# EAGLE design MakerBot (EAGLE 6.2)
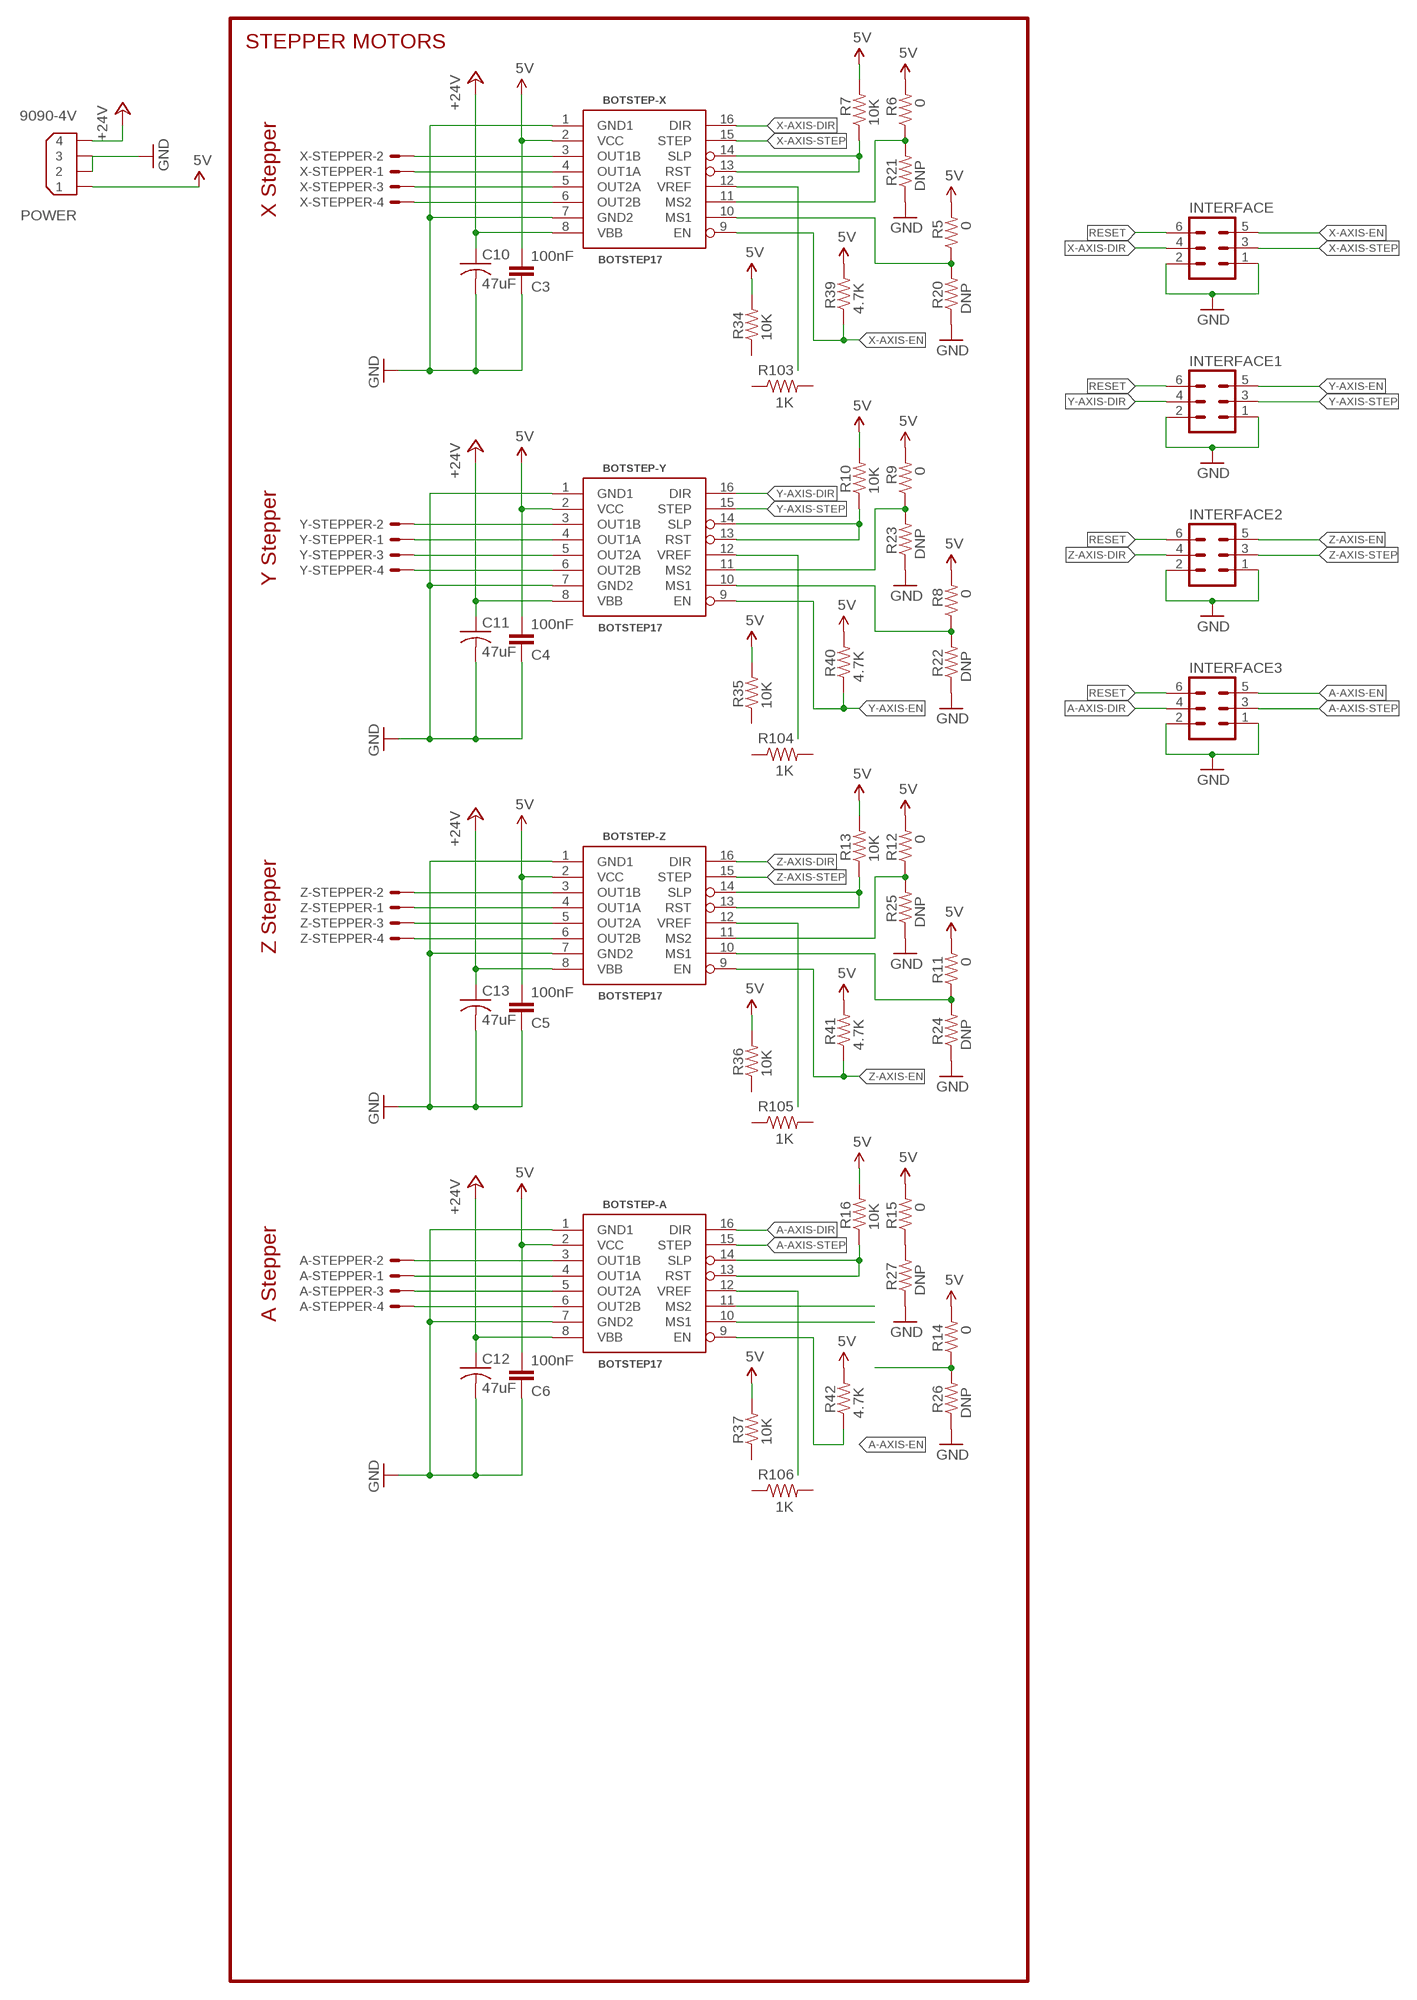
[diagram p0: schematic, sheet 1]

## Parts
A-STEPPER  KK-156-4  [KK-156-4]
BOTSTEP-A  BOTSTEP17  BOTSTEP17CHIP-DOWN  [BOTSTEP17-INV]
BOTSTEP-X  BOTSTEP17  BOTSTEP17CHIP-DOWN  [BOTSTEP17-INV]
BOTSTEP-Y  BOTSTEP17  BOTSTEP17CHIP-DOWN  [BOTSTEP17-INV]
BOTSTEP-Z  BOTSTEP17  BOTSTEP17CHIP-DOWN  [BOTSTEP17-INV]
C3  100nF  CAP0805  [0805]
C4  100nF  CAP0805  [0805]
C5  100nF  CAP0805  [0805]
C6  100nF  CAP0805  [0805]
C10  47uF  C-US050-075X075  [C050-075X075]
C11  47uF  C-US050-075X075  [C050-075X075]
C12  47uF  C-US050-075X075  [C050-075X075]
C13  47uF  C-US050-075X075  [C050-075X075]
INTERFACE  ML6  [ML6]
INTERFACE1  ML6  [ML6]
INTERFACE2  ML6  [ML6]
INTERFACE3  ML6  [ML6]
POWER  9090-4V  [9090-4V]
R5  0  RESISTORPTH1  [AXIAL-0.3]
R6  0  RESISTORPTH1  [AXIAL-0.3]
R7  10K  RESISTORPTH1  [AXIAL-0.3]
R8  0  RESISTORPTH1  [AXIAL-0.3]
R9  0  RESISTORPTH1  [AXIAL-0.3]
R10  10K  RESISTORPTH1  [AXIAL-0.3]
R11  0  RESISTOR  [0805]
R12  0  RESISTOR  [0805]
R13  10K  RESISTOR  [0805]
R14  0  RESISTOR  [0805]
R15  0  RESISTOR  [0805]
R16  10K  RESISTOR  [0805]
R20  DNP  RESISTORPTH1  [AXIAL-0.3]
R21  DNP  RESISTORPTH1  [AXIAL-0.3]
R22  DNP  RESISTORPTH1  [AXIAL-0.3]
R23  DNP  RESISTORPTH1  [AXIAL-0.3]
R24  DNP  RESISTOR  [0805]
R25  DNP  RESISTOR  [0805]
R26  DNP  RESISTOR  [0805]
R27  DNP  RESISTOR  [0805]
R34  10K  RESISTORPTH1  [AXIAL-0.3]
R35  10K  RESISTORPTH1  [AXIAL-0.3]
R36  10K  RESISTOR  [0805]
R37  10K  RESISTOR  [0805]
R39  4.7K  RESISTORPTH1  [AXIAL-0.3]
R40  4.7K  RESISTORPTH1  [AXIAL-0.3]
R41  4.7K  RESISTOR  [0805]
R42  4.7K  RESISTOR  [0805]
R103  1K  RESISTORPTH1  [AXIAL-0.3]
R104  1K  RESISTORPTH1  [AXIAL-0.3]
R105  1K  RESISTOR  [0805]
R106  1K  RESISTOR  [0805]
X-STEPPER  KK-156-4  [KK-156-4]
Y-STEPPER  KK-156-4  [KK-156-4]
Z-STEPPER  KK-156-4  [KK-156-4]

## Nets
5V [5V]: BOTSTEP-A.2(VCC) BOTSTEP-X.2(VCC) BOTSTEP-Y.2(VCC) BOTSTEP-Z.2(VCC) C3.2 C4.2 C5.2 C6.2 POWER.1 R5.P$2 R6.P$2 R7.P$2 R8.P$2 R9.P$2 R10.P$2 R11.2 R12.2 R13.2 R14.2 R15.2 R16.2 R34.P$2 R35.P$2 R36.2 R37.2 R39.P$2 R40.P$2 R41.2 R42.2
+24V [24V]: BOTSTEP-A.8(VBB) BOTSTEP-X.8(VBB) BOTSTEP-Y.8(VBB) BOTSTEP-Z.8(VBB) C10.1 C11.1 C12.1 C13.1 POWER.4
A-AXIS-DIR: BOTSTEP-A.16(DIR) INTERFACE3.4
A-AXIS-EN: BOTSTEP-A.9(EN) INTERFACE3.5 R42.1
A-AXIS-STEP: BOTSTEP-A.15(STEP) INTERFACE3.3
GND [gnd]: BOTSTEP-A.1(GND1) BOTSTEP-A.7(GND2) BOTSTEP-X.1(GND1) BOTSTEP-X.7(GND2) BOTSTEP-Y.1(GND1) BOTSTEP-Y.7(GND2) BOTSTEP-Z.1(GND1) BOTSTEP-Z.7(GND2) C3.1 C4.1 C5.1 C6.1 C10.2 C11.2 C12.2 C13.2 INTERFACE1.1 INTERFACE1.2 INTERFACE2.1 INTERFACE2.2 INTERFACE3.1 INTERFACE3.2 INTERFACE.1 INTERFACE.2 POWER.2 POWER.3 R20.P$1 R21.P$1 R22.P$1 R23.P$1 R24.1 R25.1 R26.1 R27.1
N$1: R15.1 R27.2
N$2: R14.1 R26.2
N$18: BOTSTEP-X.10(MS1) R5.P$1 R20.P$2
N$37: BOTSTEP-X.13(RST) BOTSTEP-X.14(SLP) R7.P$1
N$96: BOTSTEP-X.12(VREF)
N$100: BOTSTEP-X.11(MS2) R6.P$1 R21.P$2
N$102: BOTSTEP-Y.13(RST) BOTSTEP-Y.14(SLP) R10.P$1
N$104: BOTSTEP-X.3(OUT1B) X-STEPPER.2
N$105: BOTSTEP-X.4(OUT1A) X-STEPPER.1
N$106: BOTSTEP-X.5(OUT2A) X-STEPPER.3
N$107: BOTSTEP-X.6(OUT2B) X-STEPPER.4
N$111: BOTSTEP-Y.12(VREF)
N$114: BOTSTEP-Y.11(MS2) R9.P$1 R23.P$2
N$115: BOTSTEP-Y.3(OUT1B) Y-STEPPER.2
N$117: BOTSTEP-Y.4(OUT1A) Y-STEPPER.1
N$118: BOTSTEP-Y.5(OUT2A) Y-STEPPER.3
N$120: BOTSTEP-Y.6(OUT2B) Y-STEPPER.4
N$121: BOTSTEP-Y.10(MS1) R8.P$1 R22.P$2
N$122: BOTSTEP-Z.13(RST) BOTSTEP-Z.14(SLP) R13.1
N$124: BOTSTEP-Z.12(VREF)
N$161: BOTSTEP-Z.11(MS2) R12.1 R25.2
N$162: BOTSTEP-Z.3(OUT1B) Z-STEPPER.2
N$163: BOTSTEP-Z.4(OUT1A) Z-STEPPER.1
N$164: BOTSTEP-Z.5(OUT2A) Z-STEPPER.3
N$165: BOTSTEP-Z.6(OUT2B) Z-STEPPER.4
N$166: BOTSTEP-Z.10(MS1) R11.1 R24.2
N$172: BOTSTEP-A.13(RST) BOTSTEP-A.14(SLP) R16.1
N$173: BOTSTEP-A.12(VREF)
N$177: BOTSTEP-A.11(MS2)
N$179: A-STEPPER.2 BOTSTEP-A.3(OUT1B)
N$182: A-STEPPER.1 BOTSTEP-A.4(OUT1A)
N$183: A-STEPPER.3 BOTSTEP-A.5(OUT2A)
N$185: A-STEPPER.4 BOTSTEP-A.6(OUT2B)
N$188: BOTSTEP-A.10(MS1)
RESET: INTERFACE1.6 INTERFACE2.6 INTERFACE3.6 INTERFACE.6
X-AXIS-DIR: BOTSTEP-X.16(DIR) INTERFACE.4
X-AXIS-EN: BOTSTEP-X.9(EN) INTERFACE.5 R39.P$1
X-AXIS-STEP: BOTSTEP-X.15(STEP) INTERFACE.3
Y-AXIS-DIR: BOTSTEP-Y.16(DIR) INTERFACE1.4
Y-AXIS-EN: BOTSTEP-Y.9(EN) INTERFACE1.5 R40.P$1
Y-AXIS-STEP: BOTSTEP-Y.15(STEP) INTERFACE1.3
Z-AXIS-DIR: BOTSTEP-Z.16(DIR) INTERFACE2.4
Z-AXIS-EN: BOTSTEP-Z.9(EN) INTERFACE2.5 R41.1
Z-AXIS-STEP: BOTSTEP-Z.15(STEP) INTERFACE2.3
Unconnected: R34.P$1 R35.P$1 R36.1 R37.1 R103.P$1 R103.P$2 R104.P$1 R104.P$2 R105.1 R105.2 R106.1 R106.2

## Notes on the sheet
- STEPPER MOTORS
- X Stepper
- Y Stepper
- Z Stepper
- A Stepper

## Library data of the parts
A-STEPPER X-STEPPER Y-STEPPER Z-STEPPER = con-molex:KK-156-4: KK 156 HEADER Source: http://www.molex.com/pdm_docs/sd/026604100_sd.pdf; OC_FARNELL: unknown; OC_NEWARK: unknown
BOTSTEP-A BOTSTEP-X BOTSTEP-Y BOTSTEP-Z = MakerBot:BOTSTEP17
C3-C6 = SparkFun:CAP: Capacitor Standard 0603 ceramic capacitor, and 0.1" leaded capacitor.
C10-C13 = adafruit:C-US: CAPACITOR, American symbol
INTERFACE INTERFACE1-INTERFACE3 = con-ml:ML6: HARTING
POWER = con-thomas-betts:9090-4: Disk Drive Power four position Source: Thomas & Betts Electronic Interconnects Eiropean Edition 1998
R5-R16 R20-R27 R34-R37 R39-R42 R103-R106 = SparkFun:RESISTOR: Resistor Basic schematic elements and footprints for 0603, 1206, and PTH 1/10th watt (small) resistors.

## Net classes
0 default: width 0.203 mm, drill 0.508 mm, clearance 0.203 mm
1 24V: width 0.889 mm, drill 0.635 mm, clearance 0.508 mm
2 gnd: width 0.381 mm, drill 0.508 mm, clearance 0.254 mm
3 5V: width 0.381 mm, drill 0.508 mm, clearance 0.254 mm
4 3.3V: width 0.381 mm, drill 0.508 mm, clearance 0.254 mm
5 DC Motor: width 0.762 mm, drill 0.635 mm, clearance 0.254 mm

## Board
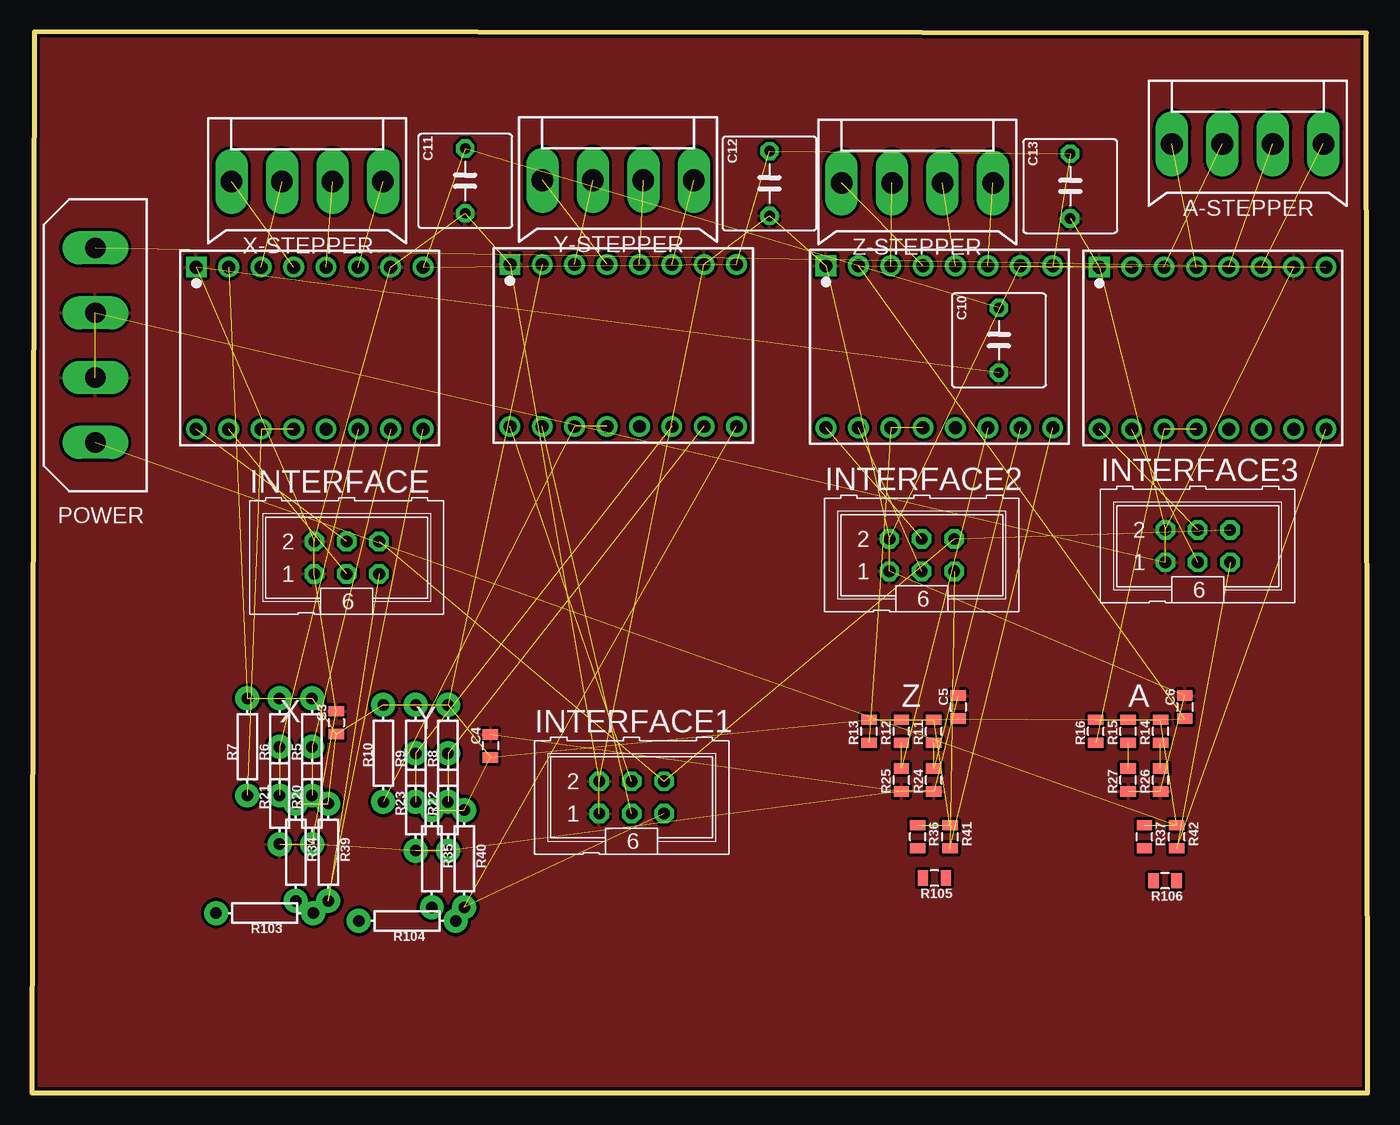
[diagram p1: board, top side]
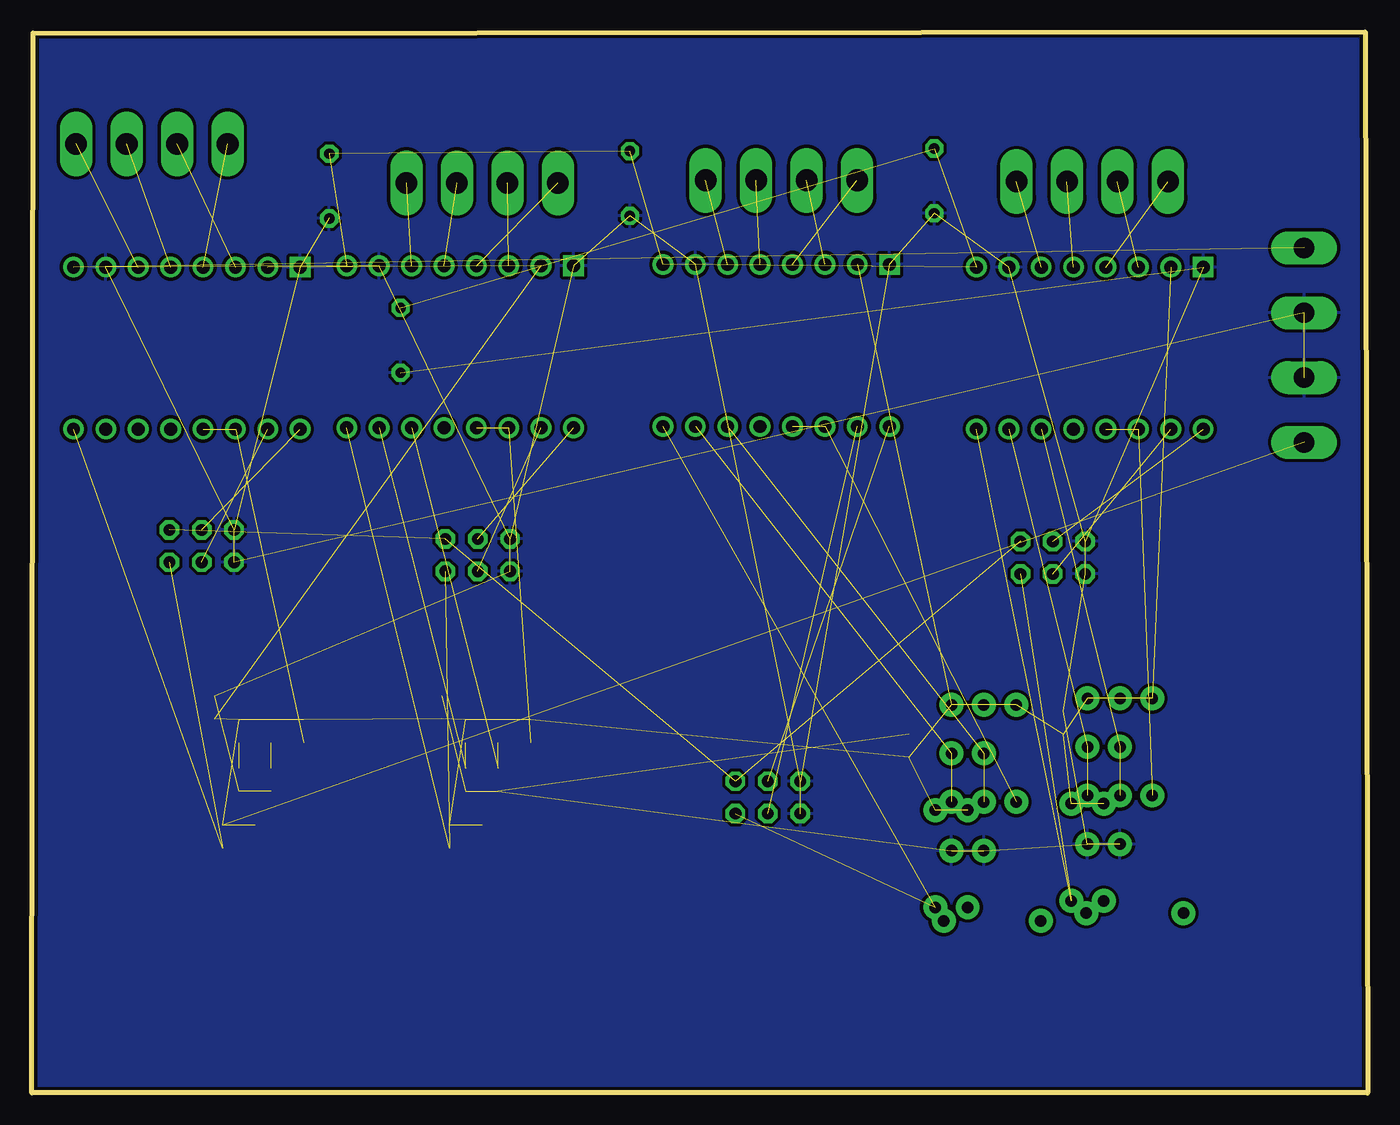
[diagram p2: board, bottom side, seen from below]

Size 104.76 x 83.19 mm. Coordinates in mm from the lower left corner, seen from the top.
Outline: 0,0 104.76,0 104.66,83.08 0.2,83.19 0,0
Copper layers (1*16): Top 0.035mm / dielectric 1.5mm / Bottom 0.035mm
Design rules: minimum track width 8mil, minimum drill 20mil, track to track 8mil, track to pad 8mil, pad to pad 8mil, via to via 8mil, smd to smd 0mil, copper to edge 10mil, drill to drill 8mil, minimum pad ring 12mil, minimum via ring 10mil, stop-mask expansion 4mil, vias tented up to drill 25mil, thermal gap 10mil

### Footprints (pad centres in the part's own frame; a part is rotated, then mirrored left to right if it is on the bottom)
KK-156-4 = drill 1.7 pad 2.184 long: 1 -5.94,0; 2 -1.98,0; 3 1.98,0; 4 5.94,0
BOTSTEP17-INV = drill 1.016 square: 1 6.35,8.89 | drill 1.016: 2 6.35,6.35; 3 6.35,3.81; 4 6.35,1.27; 5 6.35,-1.27; 6 6.35,-3.81; 7 6.35,-6.35; 8 6.35,-8.89; 9 -6.35,-8.89; 10 -6.35,-6.35; 11 -6.35,-3.81; 12 -6.35,-1.27; 13 -6.35,1.27; 14 -6.35,3.81; 15 -6.35,6.35; 16 -6.35,8.89
0805 = smd 0.8 x 1.2: 1 -0.9,0; 2 0.9,0
C050-075X075 = drill 0.813 octagon: 1 -2.54,0; 2 2.54,0
ML6 = drill 0.914 octagon: 1 -2.54,-1.27; 2 -2.54,1.27; 3 0,-1.27; 4 0,1.27; 5 2.54,-1.27; 6 2.54,1.27
9090-4V = drill 1.6 pad 2.6 long: 1 -7.62,0; 2 -2.54,0; 3 2.54,0; 4 7.62,0
AXIAL-0.3 = drill 0.9 pad 1.88: P$1 -3.81,0; P$2 3.81,0

### Placement (x,y rotation side)
A-STEPPER  95.35,74.4 0 top
BOTSTEP-A  92.61,58.39 90 top
BOTSTEP-X  21.79,58.39 90 top
BOTSTEP-Y  46.38,58.6 90 top
BOTSTEP-Z  71.17,58.5 90 top
C3  23.88,29.03 270 top
C4  35.97,27.2 270 top
C5  72.64,30.25 270 top
C6  90.42,30.25 270 top
C10  75.84,59 270 top
C11  33.99,71.5 270 top
C12  57.86,71.3 270 top
C13  81.43,71.09 270 top
INTERFACE  24.69,41.96 0 top
INTERFACE1  47.04,23.16 0 top
INTERFACE2  69.8,42.16 0 top
INTERFACE3  91.44,42.88 0 top
POWER  4.98,58.62 90 top
R5  21.97,27.13 90 top
R6  19.43,27.13 90 top
R7  16.89,27.13 90 top
R8  32.64,26.62 90 top
R9  30.1,26.62 90 top
R10  27.56,26.62 90 top
R11  70.74,28.35 90 top
R12  68.2,28.35 90 top
R13  65.66,28.35 90 top
R14  88.52,28.35 90 top
R15  85.98,28.35 90 top
R16  83.44,28.35 90 top
R20  21.97,23.32 90 top
R21  19.43,23.32 90 top
R22  32.64,22.81 90 top
R23  30.1,22.81 90 top
R24  70.74,24.54 90 top
R25  68.2,24.54 90 top
R26  88.52,24.54 90 top
R27  85.98,24.54 90 top
R34  20.7,18.87 90 top
R35  31.37,18.36 90 top
R36  69.47,20.09 90 top
R37  87.25,20.09 90 top
R39  23.24,18.87 90 top
R40  33.91,18.36 90 top
R41  72.01,20.09 90 top
R42  89.79,20.09 90 top
R103  18.26,14.1 180 top
R104  29.44,13.49 180 top
R105  70.79,16.84 180 top
R106  88.87,16.64 180 top
X-STEPPER  21.59,71.45 0 top
Y-STEPPER  45.97,71.55 0 top
Z-STEPPER  69.44,71.35 0 top

### Tracks (layer width: path | path; a pad name or v marks a point on that pad's centre or on a via)
5V  (28 unrouted)
+24V  (8 unrouted)
A-AXIS-DIR  (1 unrouted)
A-AXIS-EN  (2 unrouted)
A-AXIS-STEP  (1 unrouted)
GND  (33 unrouted)
  pour Bottom: -1.04,84.63 105.61,84.33 105.51,-1.24 -1.27,-1.27
  pour Top: -0.74,84.43 -1.27,-1.27 105.82,-1.14 105.71,84.23
N$1  (1 unrouted)
N$2  (1 unrouted)
N$18  (2 unrouted)
N$37  (2 unrouted)
N$100  (2 unrouted)
N$102  (2 unrouted)
N$104  (1 unrouted)
N$105  (1 unrouted)
N$106  (1 unrouted)
N$107  (1 unrouted)
N$114  (2 unrouted)
N$115  (1 unrouted)
N$117  (1 unrouted)
N$118  (1 unrouted)
N$120  (1 unrouted)
N$121  (2 unrouted)
N$122  (2 unrouted)
N$161  (2 unrouted)
N$162  (1 unrouted)
N$163  (1 unrouted)
N$164  (1 unrouted)
N$165  (1 unrouted)
N$166  (2 unrouted)
N$172  (2 unrouted)
N$179  (1 unrouted)
N$182  (1 unrouted)
N$183  (1 unrouted)
N$185  (1 unrouted)
RESET  (3 unrouted)
X-AXIS-DIR  (1 unrouted)
X-AXIS-EN  (2 unrouted)
X-AXIS-STEP  (1 unrouted)
Y-AXIS-DIR  (1 unrouted)
Y-AXIS-EN  (2 unrouted)
Y-AXIS-STEP  (1 unrouted)
Z-AXIS-DIR  (1 unrouted)
Z-AXIS-EN  (2 unrouted)
Z-AXIS-STEP  (1 unrouted)

### Text on the board
tPlace: Z | A | X | Y